# Altium schematic sheet ECUEXT1_23.SchDoc
size A4; SheetNumber: 1; SheetTotal: 1
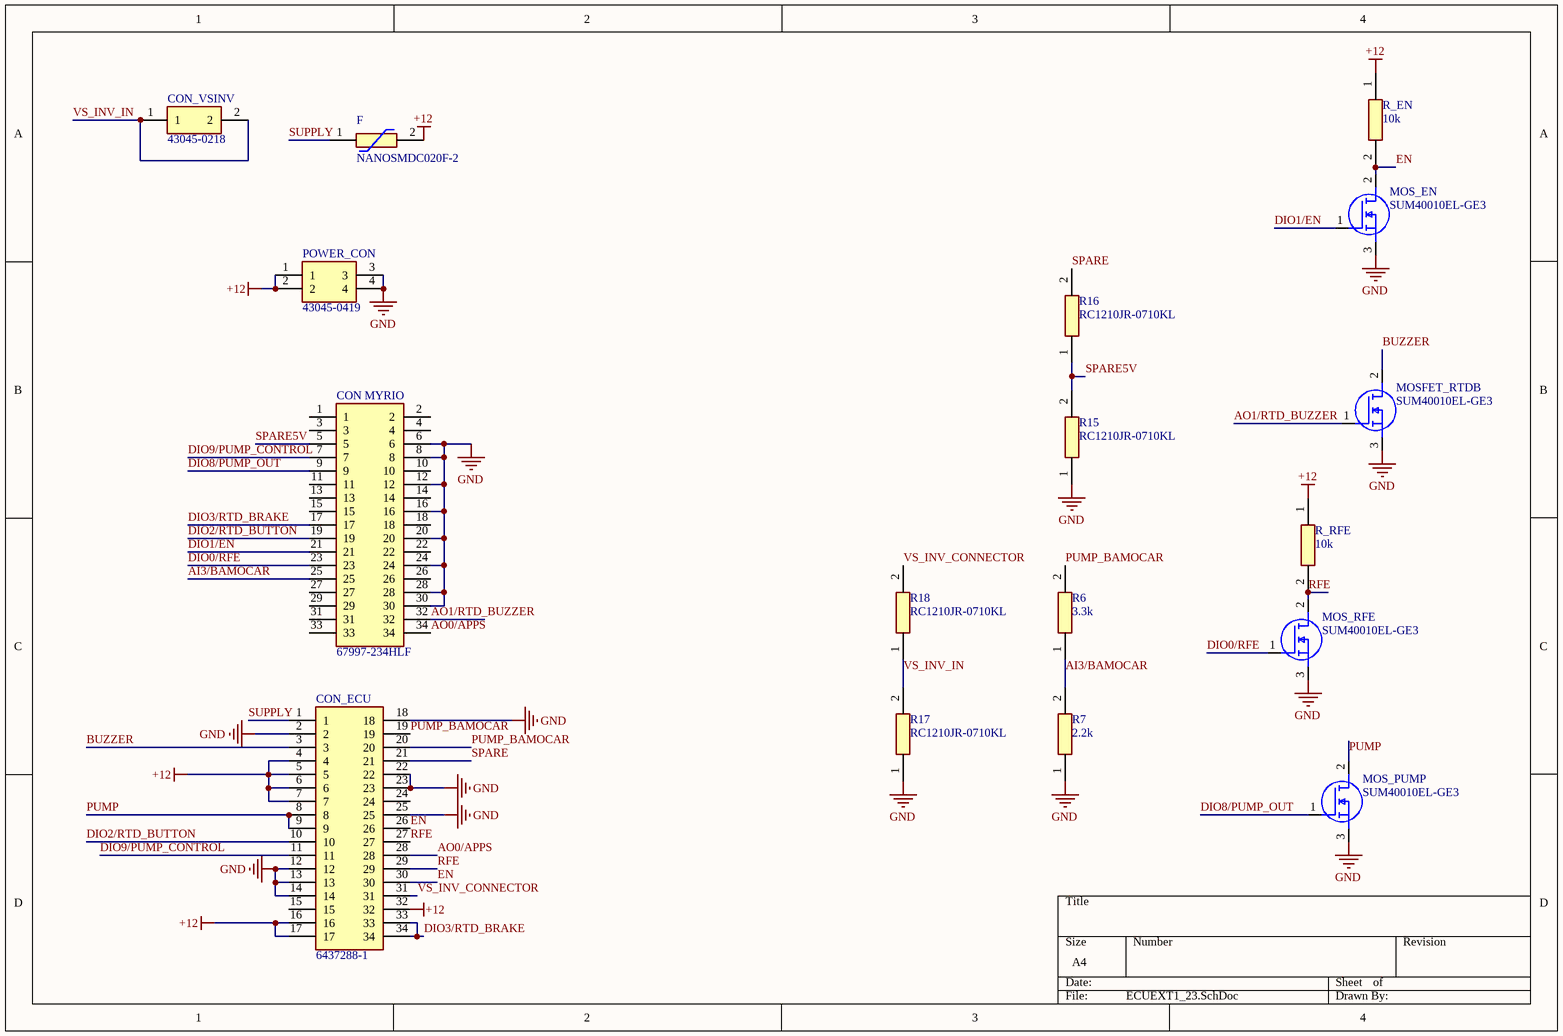
[diagram p0: ECUEXT1_23.SchDoc]

## Parts
CON_ECU  6437288-1  [6437288-1]
CON_MYRIO  67997-234HLF  [HDRV34W67P254_2X17_4318X483X858P]
CON_VSINV  43045-0218  [43045-02YY_181920]
F  NANOSMDC020F-2  [NANOSMDC016F2]
MOS_EN  SUM40010EL-GE3  [SUM40010ELGE3]
MOS_PUMP  SUM40010EL-GE3  [SUM40010ELGE3]
MOS_RFE  SUM40010EL-GE3  [SUM40010ELGE3]
MOSFET_RTDB  SUM40010EL-GE3  [SUM40010ELGE3]
POWER_CON  43045-0419  [43045-04YY_181920]
R6  3.3k  [RESC3126X60N]
R7  2.2k  [RESC3126X60N]
R15  RC1210JR-0710KL  [RESC3126X60N]
R16  RC1210JR-0710KL  [RESC3126X60N]
R17  RC1210JR-0710KL  [RESC3126X60N]
R18  RC1210JR-0710KL  [RESC3126X60N]
R_EN  10k  [RESC3126X60N]
R_RFE  10k  [RESC3126X60N]

## Nets
+12: CON_ECU.4 CON_ECU.5 CON_ECU.6 CON_ECU.7 CON_ECU.16 CON_ECU.17 CON_ECU.32 F.2 POWER_CON.1 POWER_CON.2 R_EN.1 R_RFE.1
GND: CON_ECU.2 CON_ECU.12 CON_ECU.13 CON_ECU.14 CON_ECU.18 CON_ECU.22 CON_ECU.23 CON_ECU.25 CON_MYRIO.6 CON_MYRIO.8 CON_MYRIO.12 CON_MYRIO.16 CON_MYRIO.20 CON_MYRIO.24 CON_MYRIO.28 CON_MYRIO.30 MOS_EN.3(S) MOS_PUMP.3(S) MOS_RFE.3(S) MOSFET_RTDB.3(S) POWER_CON.3 POWER_CON.4 R7.1 R15.1 R17.1
AI3/BAMOCAR: CON_MYRIO.25 R6.1 R7.2
AO0/APPS: CON_ECU.28 CON_MYRIO.34
AO1/RTD_BUZZER: CON_MYRIO.32 MOSFET_RTDB.1(G)
BUZZER: CON_ECU.3 MOSFET_RTDB.2(D)
DIO0/RFE: CON_MYRIO.23 MOS_RFE.1(G)
DIO1/EN: CON_MYRIO.21 MOS_EN.1(G)
DIO2/RTD_BUTTON: CON_ECU.10 CON_MYRIO.19
DIO3/RTD_BRAKE: CON_ECU.33 CON_ECU.34 CON_MYRIO.17
DIO8/PUMP_OUT: CON_MYRIO.9 MOS_PUMP.1(G)
DIO9/PUMP_CONTROL: CON_ECU.11 CON_MYRIO.7
EN: CON_ECU.26 CON_ECU.30 MOS_EN.2(D) R_EN.2
PUMP: CON_ECU.8 CON_ECU.9 MOS_PUMP.2(D)
PUMP_BAMOCAR: CON_ECU.19 CON_ECU.20 R6.2
RFE: CON_ECU.27 CON_ECU.29 MOS_RFE.2(D) R_RFE.2
SPARE: CON_ECU.21 R16.2
SPARE5V: CON_MYRIO.5 R15.2 R16.1
SUPPLY: CON_ECU.1 F.1
VS_INV_CONNECTOR: CON_ECU.31 R18.2
VS_INV_IN: CON_VSINV.1 CON_VSINV.2 R17.2 R18.1

Not connected (* = marked no-connect by the designer): CON_ECU 15 24; CON_MYRIO 1 2 3 4 10 11 13 14 15 18 22 26 27 29 31 33

## Library data of the parts
CON_ECU = 6437288-1: Connector; Manufacturer_Name: TE Connectivity; Datasheet Link: http://www.te.com/commerce/DocumentDelivery/DDEController?Action=srchrtrv&DocNm=6437288-1&DocType=Customer+Drawing&DocLang=Japanese; Manufacturer_Part_Number: 6437288-1; Mouser Part Number: 571-6437288-1; Mouser Price/Stock: https://www.mouser.co.uk/ProductDetail/TE-Connectivity/6437288-1?qs=WBj8811fzwGYtKR8aBSJZw%3D%3D; Arrow Part Number: 6437288-1; Arrow Price/Stock: https://www.arrow.com/en/products/6437288-1/te-connectivity
CON_MYRIO = 67997-234HLF: Connector; Manufacturer_Name: Amphenol; Datasheet Link: https://cdn.amphenol-icc.com/media/wysiwyg/files/drawing/67996.pdf; Height: 8.58mm; Manufacturer_Part_Number: 67997-234HLF; Mouser Part Number: 649-67997-234HLF; Mouser Price/Stock: https://www.mouser.co.uk/ProductDetail/Amphenol-FCI/67997-234HLF?qs=zh4O8xspOuxBU73L6U2QCQ%3D%3D; Arrow Part Number: 67997-234HLF; Arrow Price/Stock: https://www.arrow.com/en/products/67997-234hlf/amphenol-fci?region=nac
CON_VSINV = 43045-0218: Connector; Manufacturer_Name: Molex; Datasheet Link: https://www.molex.com/pdm_docs/sd/430450218_sd.pdf; Height: 9.91mm; Manufacturer_Part_Number: 43045-0218; Mouser Part Number: 538-43045-0218; Mouser Price/Stock: https://www.mouser.co.uk/ProductDetail/Molex/43045-0218?qs=4XSMV6Twtb2qUKINalLbdA%3D%3D; Arrow Part Number: 43045-0218; Arrow Price/Stock: https://www.arrow.com/en/products/43045-0218/molex
F = NANOSMDC020F-2: Resettable Fuse; Manufacturer_Name: LITTELFUSE; Datasheet Link: https://www.littelfuse.com/~/media/electronics/datasheets/resettable_ptcs/littelfuse_ptc_nanosmdc_datasheet.pdf.pdf; Height: 1mm; Manufacturer_Part_Number: NANOSMDC020F-2; Mouser Part Number: 650-NANOSMDC020F-2; Mouser Price/Stock: https://www.mouser.co.uk/ProductDetail/Littelfuse/NANOSMDC020F-2?qs=iK0evp%252BCRRU6agwMt7HYjg%3D%3D; Arrow Part Number: NANOSMDC020F-2; Arrow Price/Stock: https://www.arrow.com/en/products/nanosmdc020f-2/littelfuse
MOS_EN MOS_PUMP MOS_RFE MOSFET_RTDB = SUM40010EL-GE3: MOSFET (N-Channel); Manufacturer_Name: Vishay; Datasheet Link: https://www.vishay.com/docs/66984/sum40010el.pdf; Height: 5.08mm; Manufacturer_Part_Number: SUM40010EL-GE3; Mouser Part Number: 78-SUM40010EL-GE3; Mouser Price/Stock: https://www.mouser.com/Search/Refine.aspx?Keyword=78-SUM40010EL-GE3; Arrow Part Number: SUM40010EL-GE3; Arrow Price/Stock: https://www.arrow.com/en/products/sum40010el-ge3/vishay
POWER_CON = 43045-0419: Connector; Manufacturer_Name: Molex; Datasheet Link: https://www.molex.com/pdm_docs/sd/430450218_sd.pdf; Height: 9.91mm; Manufacturer_Part_Number: 43045-0419; Mouser Part Number: 538-43045-0419; Mouser Price/Stock: https://www.mouser.co.uk/ProductDetail/Molex/43045-0419?qs=UeCeOHRHQebVNIQyI9VWWg%3D%3D
R6 R7 R15-R18 R_EN R_RFE = RC1210JR-0710KL: Resistor; Manufacturer_Name: YAGEO (PHYCOMP); Datasheet Link: https://datasheet.datasheetarchive.com/originals/distributors/Datasheets_SAMA/902f9e387b938f871d31120f5fc1d65e.pdf; Height: 0.6mm; Manufacturer_Part_Number: RC1210JR-0710KL; Mouser Part Number: 603-RC1210JR-0710KL; Mouser Price/Stock: https://www.mouser.co.uk/ProductDetail/YAGEO/RC1210JR-0710KL?qs=6sj9KdP9svgfoubno5Jb%252BA%3D%3D; Arrow Part Number: RC1210JR-0710KL; Arrow Price/Stock: https://www.arrow.com/en/products/rc1210jr-0710kl/yageo